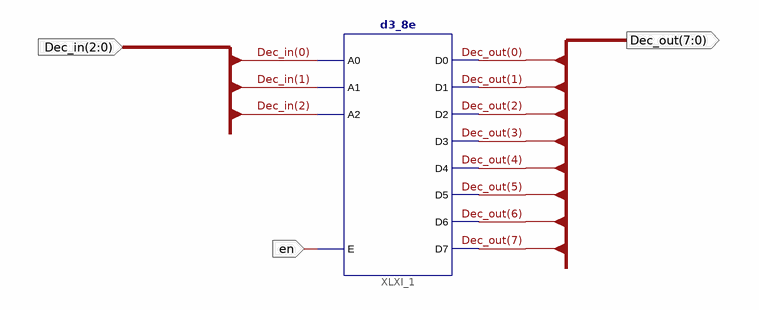
[diagram p0: schematic sheet 1]
// Xilinx ISE schematic lab07_sch.sch (spartan3e) as structural Verilog: 1 symbols, 3 ports
module lab07_sch (
  input  [2:0] Dec_in,
  input  en,
  output [7:0] Dec_out
);

  d3_8e XLXI_1 (
    .A0(Dec_in[0]), .A1(Dec_in[1]), .A2(Dec_in[2]), .E(en), .D0(Dec_out[0]), .D1(Dec_out[1]),
    .D2(Dec_out[2]), .D3(Dec_out[3]), .D4(Dec_out[4]), .D5(Dec_out[5]), .D6(Dec_out[6]), .D7(Dec_out[7]));
endmodule
